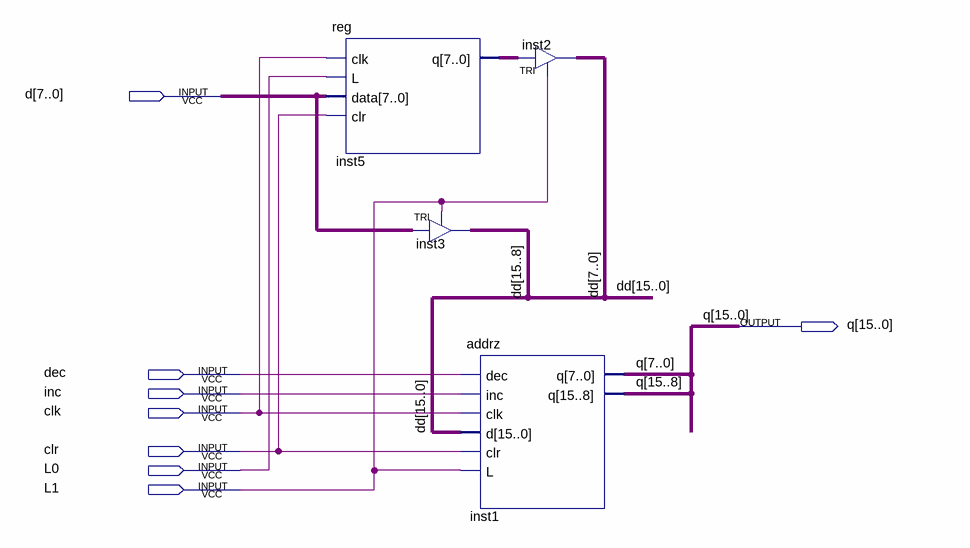
[diagram p0: schematic sheet]
// Quartus schematic addr.bdf as structural Verilog: 4 symbols, 8 pins
module addr (
  input  [7:0] d,
  input  dec,
  input  inc,
  input  clk,
  input  clr,
  input  L0,
  input  L1,
  output [15:0] q
);

  wire [7:0] inst5_q;
  wire [15:0] dd;

  \reg  inst5 (.clk(clk), .L(L0), .data(d), .clr(clr), .q(inst5_q));
  TRI inst3[7:0] (.IN(d), .OE(L1), .OUT(dd[15:8]));
  addrz inst1 (.dec(dec), .inc(inc), .clk(clk), .d(dd), .clr(clr), .L(L1), .q(q));
  TRI inst2[7:0] (.IN(inst5_q), .OE(L1), .OUT(dd[7:0]));
endmodule
